# Altium schematic sheet Drivers.SchDoc
size A3; SheetNumber: 3; SheetTotal: 6
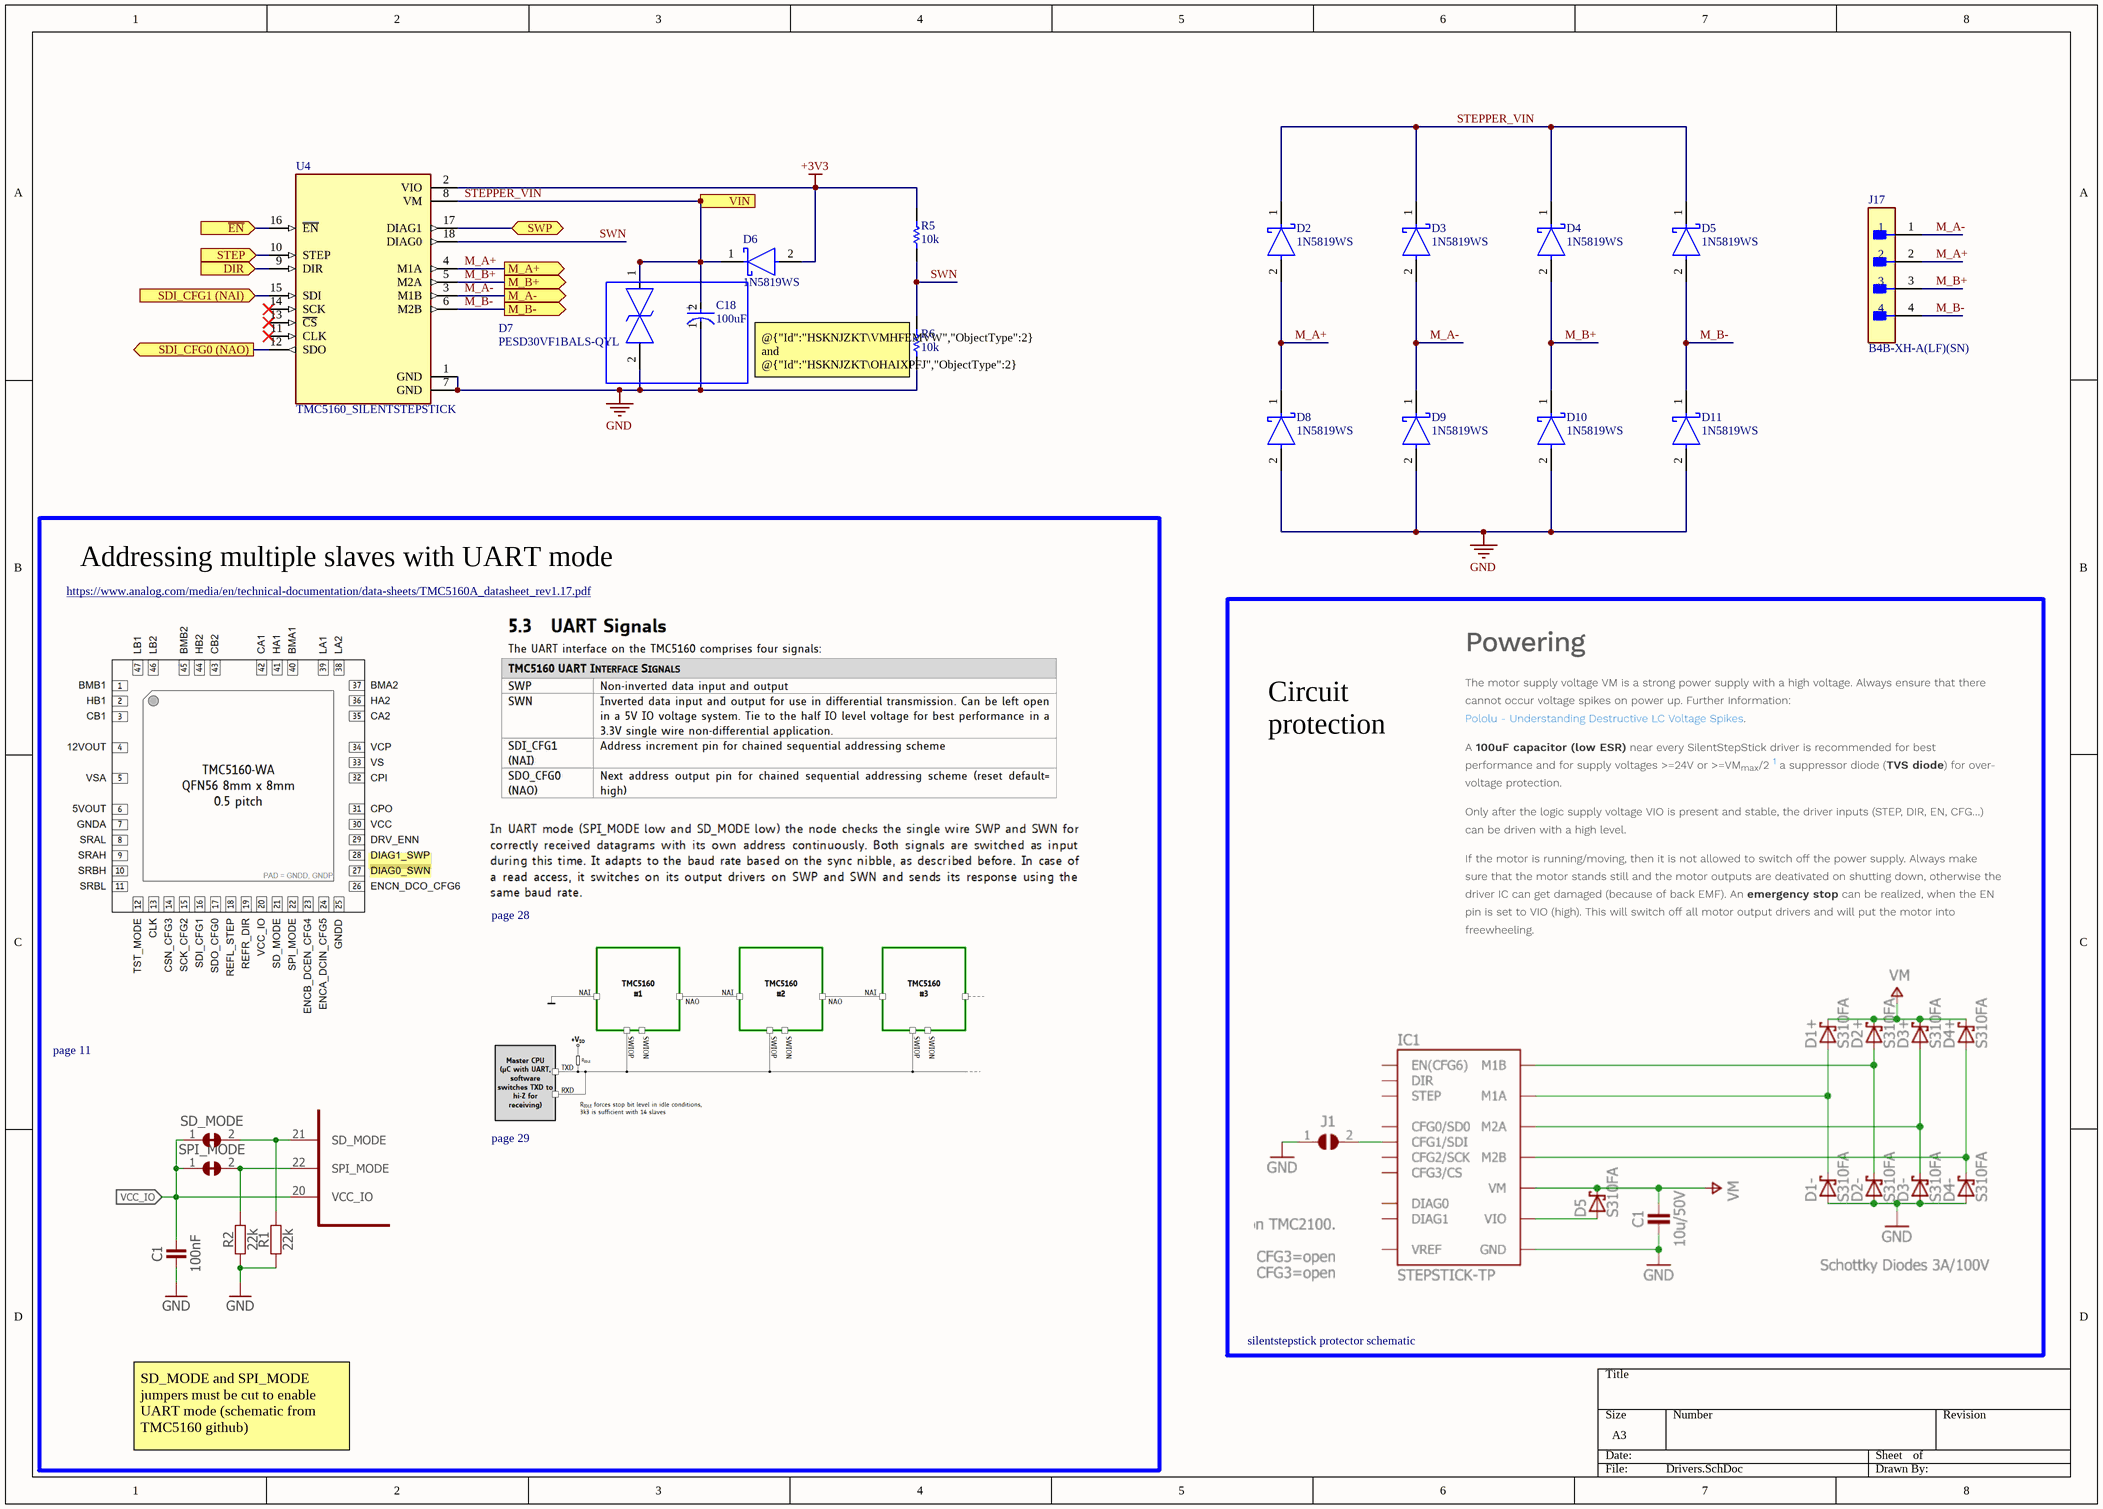
[diagram p0: Drivers.SchDoc]

## Parts
C18  100uF  [FP-UWT1H101MNL1GS-MFG]
D2  1N5819WS  [FP-477-02-MFG]
D3  1N5819WS  [FP-477-02-MFG]
D4  1N5819WS  [FP-477-02-MFG]
D5  1N5819WS  [FP-477-02-MFG]
D6  1N5819WS  [FP-477-02-MFG]
D7  PESD30VF1BALS-QYL  [PESD30VF1BALSQYL]
D8  1N5819WS  [FP-477-02-MFG]
D9  1N5819WS  [FP-477-02-MFG]
D10  1N5819WS  [FP-477-02-MFG]
D11  1N5819WS  [FP-477-02-MFG]
J17  B4B-XH-A(LF)(SN)  [FP-B4B-XH-A_LF_SN-MFG]
R5  Resistance: 10k  [RESC1609X50X30NL8T20]  (hidden comment: 0603WAF1002T5E)
R6  Resistance: 10k  [RESC1609X50X30NL8T20]  (hidden comment: 0603WAF1002T5E)
U4  TMC5160_SILENTSTEPSTICK  [MODULE_TMC5160_SILENTSTEPSTICK]

## Ports
DIR (in, see Actuation[3D]), M_A+ (out, see Actuation[4C]), M_A- (out, see Actuation[4C]), M_B+ (out, see Actuation[4D]), M_B- (out, see Actuation[4D]), SDI_CFG0 (NAO) (out, see Actuation[4D]), SDI_CFG1 (NAI) (in, see Actuation[3D]), STEP (in, see Actuation[3D]), SWP (bidir, see Actuation[3D]), VIN (in, see Actuation[3C], Power[1A]), ~{EN} (in, see Actuation[3C])

## Nets
+3V3: D6.2(A) R5.2 U4.2(VIO)
GND: C18.1(C) D7.2 D8.2(A) D9.2(A) D10.2(A) D11.2(A) R6.1 U4.1(GND) U4.7(GND)
DIR: U4.9(DIR) ; port DIR
~{EN}: U4.16(~{EN}) ; port ~{EN}
M_A+: D2.2(A) D8.1(C) J17.2 U4.4(M1A) ; port M_A+
M_A-: D3.2(A) D9.1(C) J17.1 U4.3(M1B) ; port M_A-
M_B+: D4.2(A) D10.1(C) J17.3 U4.5(M2A) ; port M_B+
M_B-: D5.2(A) D11.1(C) J17.4 U4.6(M2B) ; port M_B-
SDI_CFG0 (NAO): U4.12(SDO) ; port SDI_CFG0 (NAO)
SDI_CFG1 (NAI): U4.15(SDI) ; port SDI_CFG1 (NAI)
STEP: U4.10(STEP) ; port STEP
STEPPER_VIN: C18.2(A) D2.1(C) D3.1(C) D4.1(C) D5.1(C) D6.1(C) D7.1 U4.8(VM) ; port VIN
SWN: R5.1 R6.2 U4.18(DIAG0)
SWP: U4.17(DIAG1) ; port SWP

Not connected (* = marked no-connect by the designer): U4 11(CLK)* 13(~{CS})* 14(SCK)*

## Notes on the sheet
- (near R6) @{"Id":"HSKNJZKT\VMHFEMVW","ObjectType":2} and @{"Id":"HSKNJZKT\OHAIXPFJ","ObjectType":2} sized for asv specifications, double check whether fits auv specs
- Addressing multiple slaves with UART mode
- https://www.analog.com/media/en/technical-documentation/data-sheets/TMC5160A_datasheet_rev1.17.pdf
- Circuit protection
- page 28
- page 11
- page 29
- silentstepstick protector schematic
- SD_MODE and SPI_MODE jumpers must be cut to enable UART mode (schematic from TMC5160 github)
- (in symbol CMP-2000-07373-2) +

## Library data of the parts
C18 = CMP-2000-07373-2: CAP ALUM 100UF 20% 50V SMD; Leakage Current: 3uA; Ripple Current: 140mA; Life (Hours): 1000Hour; Dissipation Factor: 0.14%; Dielectric Material: Aluminium; Termination: SMD/SMT; Tolerance: 20%; Package Quantity: 500; Capacitance: 100uF; Height: 10mm; REACH SVHC: No SVHC; Case/Package: Radial; Series: WT; Diameter: 8mm; Voltage Rating: 50V; Construction: Cylindrical; Length: 10mm; Min Operating Temperature: -55°C; Max Operating Temperature: 105°C; Voltage Rating (DC): 50V; Packaging: Tape and Reel; Voltage: 50V; Mount: Surface Mount; Ripple Current (AC): 140mA; Radiation Hardening: No; Number of Pins: 2; Lead Free: Lead Free; Height - Seated (Max): 0.413inch; RoHS Compliant: Yes
D2-D6 D8-D11 = CMP-1055-00464-2: 40V 600mV@1A 1A SOD-323 Schottky Barrier Diodes (SBD) ROHS; Standoff Height: 0mm; Category: Diode; Package: 477-02; Height: 1.1mm
D7 = CMP-241-000004-1: 21V (Typ) Clamp Ipp Tvs Diode Surface Mount DFN1006-2; Manufacturer_Name: Nexperia; Datasheet Link: https://assets.nexperia.com/documents/data-sheet/PESD30VF1BALS-Q.pdf; Height: 0.5mm; Manufacturer_Part_Number: PESD30VF1BALS-QYL; Mouser Part Number: 771-PESD30VF1BALSQYL; Mouser Price/Stock: https://www.mouser.co.uk/ProductDetail/Nexperia/PESD30VF1BALS-QYL?qs=dbcCsuKDzFU1CRQIDaUBEA%3D%3D; Source: SamacSys.SchLib; Design Item ID: PESD30VF1BALS-QYL
J17 = CMP-17439-000250-1: CONN HEADER VERT 4POS 2.5MM; Number of Contacts: 4; Contact Resistance: 20mR; Voltage Rating: 250V; Max Current Rating: 3A; Gender: Male; Wire/Cable Gauge: 22AWG; Mated Stacking Heights: 9.8mm; Insulation Resistance: 1GR; Orientation: Straight; Contact Type: Male Pin; Contact Finish - Mating: TIN; Series: XH; Max Voltage Rating (AC): 250V; Lead Pitch: 2.5mm; Contact Shape: Square; Insulation Color: Natural; Termination: Solder; Lead Free: Lead Free; Voltage Rating (AC): 250V; Number of Rows: 1; Flammability Rating: UL94 V-0; Number of Positions: 4; Max Operating Temperature: 85°C; Package Quantity: 500; Mount: Through Hole; REACH SVHC: No SVHC; Connector Type: Header; Insulation Material: Nylon; Fastening Type: Detent; Min Operating Temperature: -25°C; Housing Color: White; Packaging: Bulk; Contact Plating: Tin; Contact Material: Brass; Max Voltage Rating (DC): 250V; Housing Material: Polyamide; Color: Natural; Material: Polyamide; Pitch: 2.5mm; Depth: 5.75mm; Current Rating: 3A; Length: 12.4mm
R5 R6 = CMP-1666-00005-4: 100mW Thick Film Resistors 75V ±100ppm/℃ ±1% 10kΩ 0603 Chip Resistor - Surface Mount ROHS; Max Operating Temperature: 155 degC; Voltage Rating: 75 V; PackageDescription: 2-Pin Surface Mount Device, Body 1.575 x 0.85 mm; ComponentLink1Description: Manufacturer URL; RoHSCompliant: true; PackageReference: 0603; REACH SVHC: Unknown; Length: 1.55 mm; Packaging: Tape and Reel; Min Operating Temperature: -55 degC; Mounting Technology: Surface Mount; ComponentLink2URL: https://datasheet.ciiva.com/11809/0900766b80d98afc-11809037.pdf; Height: 0.45 mm; ComponentLink2Description: Datasheet; Package Quantity: 5000; ComponentLink1URL: http://www.vishay.com/
U4 = CMP-092-000004-2: TMC5160 SilentStepStick Motor Driver; MF: Trinamic Motion Control GmbH; Value: *; MP: TMC5160_SILENTSTEPSTICK; Design Item ID: TMC5160_SILENTSTEPSTICK; Check_prices: https://www.snapeda.com/parts/TMC5160%20SILENTSTEPSTICK/Trinamic%20Motion%20Control%20GmbH/view-part/?ref=search&t=tmc5160%20silentstep%20stick; Package: None; Source: TMC5160_SILENTSTEPSTICK.SchLib; Pin Count: 18; SnapEDA_Link: https://www.snapeda.com/parts/TMC5160%20SILENTSTEPSTICK/Trinamic%20Motion%20Control%20GmbH/view-part/?ref=search&t=tmc5160%20silentstep%20stick; Price: None; Availability: In Stock; Purchase-URL: https://pricing.snapeda.com/parts/TMC5160SILENTSTEPSTICK/Trinamic%20Motion%20Control%20GmbH/view-part?uid=6097338; Component Type: Standard